# Altium schematic sheet Sheet1.SchDoc
size A4
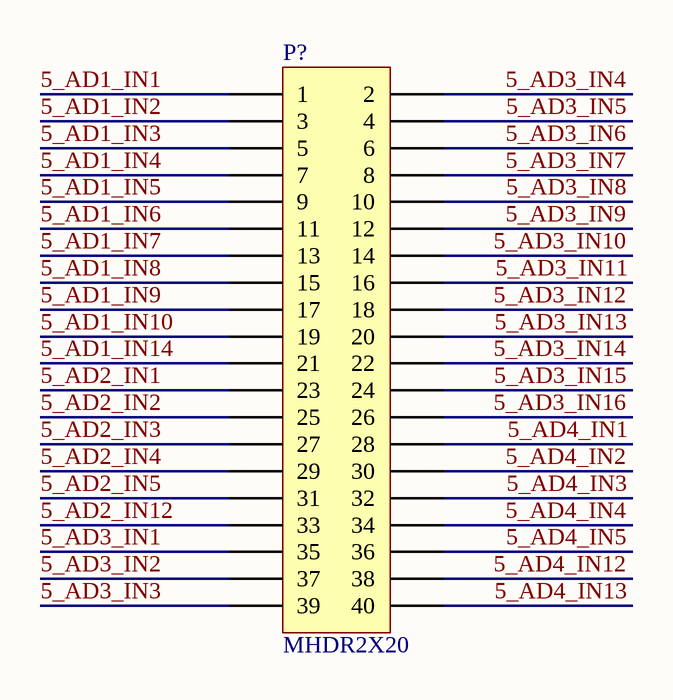
[diagram p0: Sheet1.SchDoc]

## Parts
P?  MHDR2X20  [MHDR2X20]

## Nets
5_AD1_IN1: P?.1
5_AD1_IN2: P?.3
5_AD1_IN3: P?.5
5_AD1_IN4: P?.7
5_AD1_IN5: P?.9
5_AD1_IN6: P?.11
5_AD1_IN7: P?.13
5_AD1_IN8: P?.15
5_AD1_IN9: P?.17
5_AD1_IN10: P?.19
5_AD1_IN14: P?.21
5_AD2_IN1: P?.23
5_AD2_IN2: P?.25
5_AD2_IN3: P?.27
5_AD2_IN4: P?.29
5_AD2_IN5: P?.31
5_AD2_IN12: P?.33
5_AD3_IN1: P?.35
5_AD3_IN2: P?.37
5_AD3_IN3: P?.39
5_AD3_IN4: P?.2
5_AD3_IN5: P?.4
5_AD3_IN6: P?.6
5_AD3_IN7: P?.8
5_AD3_IN8: P?.10
5_AD3_IN9: P?.12
5_AD3_IN10: P?.14
5_AD3_IN11: P?.16
5_AD3_IN12: P?.18
5_AD3_IN13: P?.20
5_AD3_IN14: P?.22
5_AD3_IN15: P?.24
5_AD3_IN16: P?.26
5_AD4_IN1: P?.28
5_AD4_IN2: P?.30
5_AD4_IN3: P?.32
5_AD4_IN4: P?.34
5_AD4_IN5: P?.36
5_AD4_IN12: P?.38
5_AD4_IN13: P?.40

## Library data of the parts
P? = MHDR2X20: Header, 20-Pin, Dual row; LatestRevisionDate: 17-Jul-2002; LatestRevisionNote: Re-released for DXP Platform.; Publisher: Altium Limited